# Altium schematic sheet sensors.SchDoc
size A3
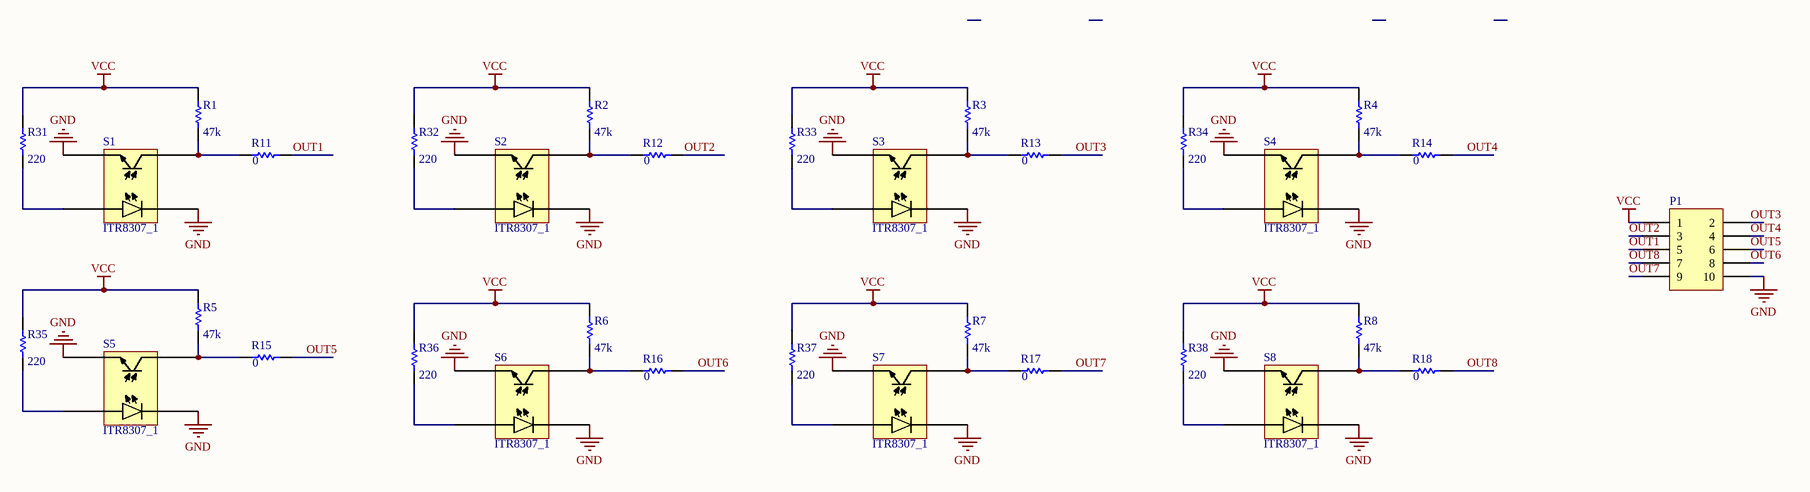
[diagram p0: sensors.SchDoc]

## Parts
P1  Header 5X2  [HDR-5x2 CON 2]  (value not drawn)
R1  value 47k  [C1206]  (hidden comment: Res1)
R2  value 47k  [C1206]  (hidden comment: Res1)
R3  value 47k  [C1206]  (hidden comment: Res1)
R4  value 47k  [C1206]  (hidden comment: Res1)
R5  value 47k  [C1206]  (hidden comment: Res1)
R6  value 47k  [C1206]  (hidden comment: Res1)
R7  value 47k  [C1206]  (hidden comment: Res1)
R8  value 47k  [C1206]  (hidden comment: Res1)
R11  value 0  [C1206]  (hidden comment: Res1)
R12  value 0  [C1206]  (hidden comment: Res1)
R13  value 0  [C1206]  (hidden comment: Res1)
R14  value 0  [C1206]  (hidden comment: Res1)
R15  value 0  [C1206]  (hidden comment: Res1)
R16  value 0  [C1206]  (hidden comment: Res1)
R17  value 0  [C1206]  (hidden comment: Res1)
R18  value 0  [C1206]  (hidden comment: Res1)
R31  value 220  [C1206]  (hidden comment: Res1)
R32  value 220  [C1206]  (hidden comment: Res1)
R33  value 220  [C1206]  (hidden comment: Res1)
R34  value 220  [C1206]  (hidden comment: Res1)
R35  value 220  [C1206]  (hidden comment: Res1)
R36  value 220  [C1206]  (hidden comment: Res1)
R37  value 220  [C1206]  (hidden comment: Res1)
R38  value 220  [C1206]  (hidden comment: Res1)
S1  ITR8307_1  [ITR8307 - TH]
S2  ITR8307_1  [ITR8307 - TH]
S3  ITR8307_1  [ITR8307 - TH]
S4  ITR8307_1  [ITR8307 - TH]
S5  ITR8307_1  [ITR8307 - TH]
S6  ITR8307_1  [ITR8307 - TH]
S7  ITR8307_1  [ITR8307 - TH]
S8  ITR8307_1  [ITR8307 - TH]

## Nets
GND: P1.10 S1.1 S1.3 S2.1 S2.3 S3.1 S3.3 S4.1 S4.3 S5.1 S5.3 S6.1 S6.3 S7.1 S7.3 S8.1 S8.3
VCC: P1.1 R1.2 R2.2 R3.2 R4.2 R5.2 R6.2 R7.2 R8.2 R31.2 R32.2 R33.2 R34.2 R35.2 R36.2 R37.2 R38.2
OUT1: P1.5 R11.1
OUT2: P1.3 R12.1
OUT3: P1.2 R13.1
OUT4: P1.4 R14.1
OUT5: P1.6 R15.1
OUT6: P1.8 R16.1
OUT7: P1.9 R17.1
OUT8: P1.7 R18.1
NetR1_1: R1.1 R11.2 S1.4
NetR2_1: R2.1 R12.2 S2.4
NetR3_1: R3.1 R13.2 S3.4
NetR4_1: R4.1 R14.2 S4.4
NetR5_1: R5.1 R15.2 S5.4
NetR6_1: R6.1 R16.2 S6.4
NetR7_1: R7.1 R17.2 S7.4
NetR8_1: R8.1 R18.2 S8.4
NetR31_1: R31.1 S1.2
NetR32_1: R32.1 S2.2
NetR33_1: R33.1 S3.2
NetR34_1: R34.1 S4.2
NetR35_1: R35.1 S5.2
NetR36_1: R36.1 S6.2
NetR37_1: R37.1 S7.2
NetR38_1: R38.1 S8.2

## Library data of the parts
P1 = Header 5X2: Header, 5-Pin, Dual row; LatestRevisionDate: 17-Jul-2002; LatestRevisionNote: Re-released for DXP Platform.; Publisher: Altium Limited
R1-R8 R11-R18 R31-R38 = Res1: Resistor; Published: 8-Jun-2000; LatestRevisionDate: 17-Jul-2002; LatestRevisionNote: Re-released for DXP Platform.; PackageReference: AXIAL-0.3; Publisher: Altium Limited; PackageDescription: Axial Device, Thru-Hole; 2 Leads; 0.3 in Pin Spacing